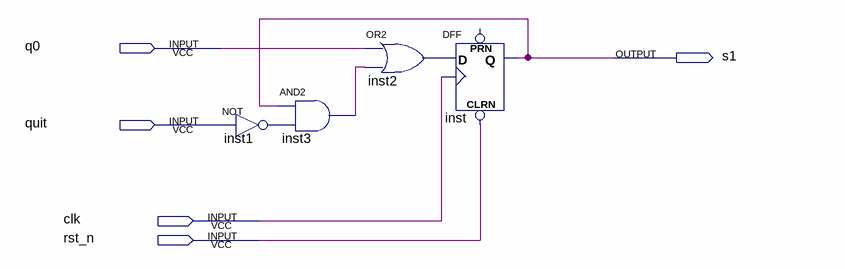
[diagram p0: schematic sheet]
// Quartus schematic s1.bdf as structural Verilog: 4 symbols, 5 pins
module s1 (
  input  q0,
  input  quit,
  input  clk,
  input  rst_n,
  output s1
);

  wire inst1_out, inst2_out, inst3_out;

  not inst1 (inst1_out, quit);
  and inst3 (inst3_out, s1, inst1_out);
  or inst2 (inst2_out, q0, inst3_out);
  DFF inst (.CLRN(rst_n), .CLK(clk), .D(inst2_out), .Q(s1));  // open: PRN
endmodule
